# EAGLE design 01 (EAGLE 6.6.0)
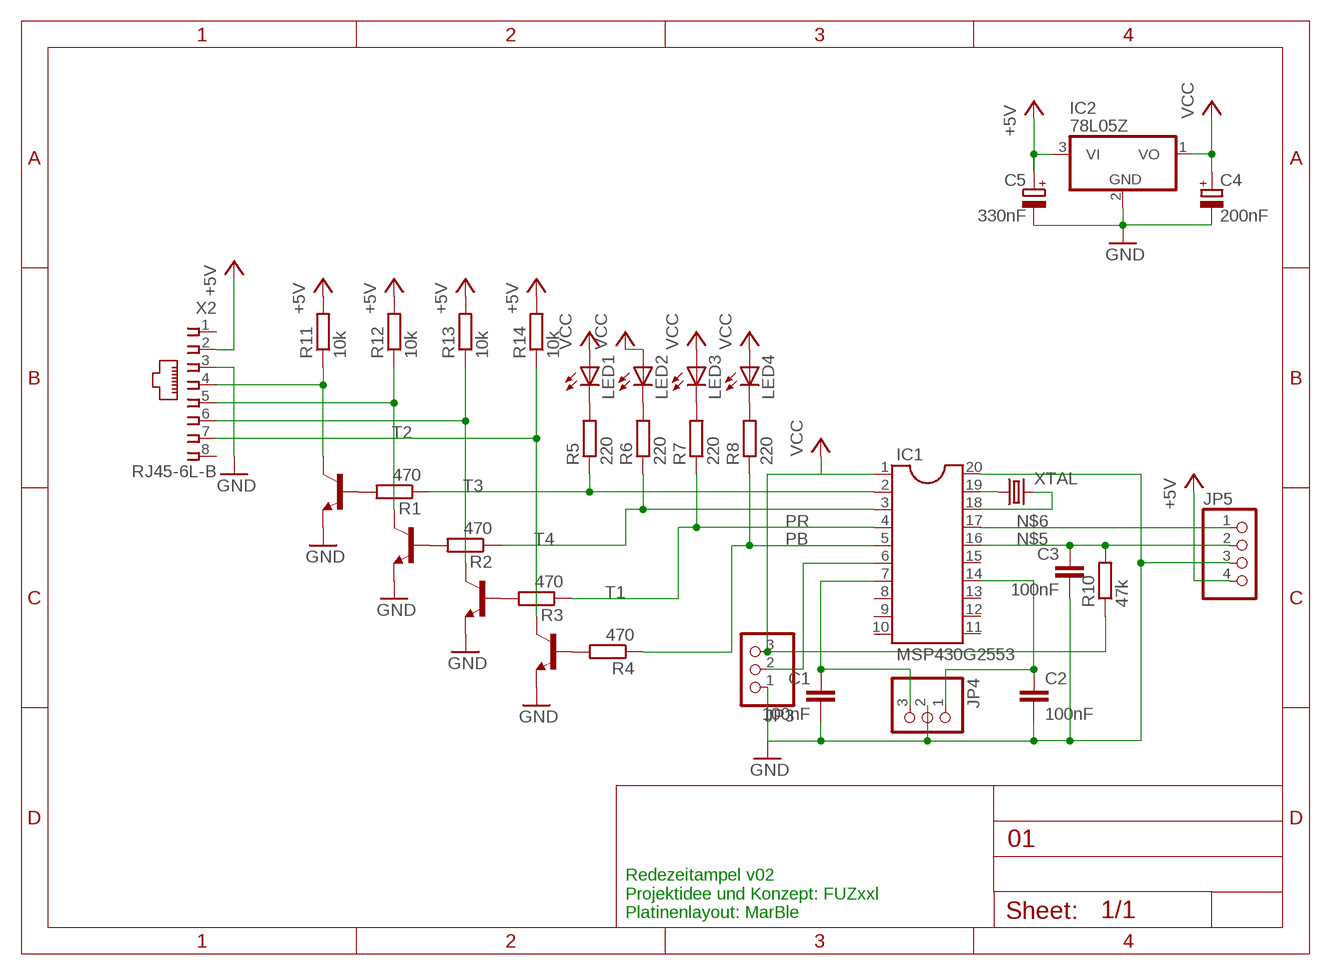
[diagram p0: schematic, sheet 1]

## Parts
C1  100nF  C-EU025-024X044  [C025-024X044]
C2  100nF  C-EU025-024X044  [C025-024X044]
C3  100nF  C-EU025-024X044  [C025-024X044]
C4  200nF  CPOL-EUB45181A  [B45181A]
C5  330nF  CPOL-EUB45181A  [B45181A]
IC1  MSP430G2553  DIL20  [DIL20]
IC2  78L05Z  [TO92]
JP3  PINHD-1X3  [1X03]
JP4  PINHD-1X3  [1X03]
JP5  PINHD-1X4/90  [1X04/90]
LED1  LED5MM  [LED5MM]
LED2  LED5MM  [LED5MM]
LED3  LED5MM  [LED5MM]
LED4  LED5MM  [LED5MM]
R1  470  R-EU_0207/10  [0207/10]
R2  470  R-EU_0207/10  [0207/10]
R3  470  R-EU_0207/10  [0207/10]
R4  470  R-EU_0207/10  [0207/10]
R5  220  R-EU_0207/10  [0207/10]
R6  220  R-EU_0207/10  [0207/10]
R7  220  R-EU_0207/10  [0207/10]
R8  220  R-EU_0207/10  [0207/10]
R10  47k  R-EU_0207/10  [0207/10]
R11  10k  R-EU_0207/10  [0207/10]
R12  10k  R-EU_0207/10  [0207/10]
R13  10k  R-EU_0207/10  [0207/10]
R14  10k  R-EU_0207/10  [0207/10]
T1  -NPN-TO92-EBC  [TO92-EBC]
T2  -NPN-TO92-EBC  [TO92-EBC]
T3  -NPN-TO92-EBC  [TO92-EBC]
T4  -NPN-TO92-EBC  [TO92-EBC]
X2  RJ45-6L-B  [RJ45-NO-SHIELD]
XTAL  CRYSTALTC26H  [TC26H]

## Nets
+5V: C5.+ IC2.3(VI) JP5.4 R11.2 R12.2 R13.2 R14.2 X2.2
GND: C1.2 C2.2 C3.2 C4.- C5.- IC1.20 IC2.2(GND) JP3.1 JP4.2 JP5.3 T1.E T2.E T3.E T4.E X2.3
N$1: IC1.6 JP3.2
N$2: IC1.19 XTAL.1
N$3: C1.1 IC1.7 JP4.3
N$4: C2.1 IC1.14 JP4.1
N$5: C3.1 IC1.16 JP5.2 R10.2
N$6: IC1.17 JP5.1
N$7: IC1.18 XTAL.2
N$8: LED4.K(C) R8.2
N$9: IC1.3 R2.1 R6.1
N$11: R4.2 T1.B
N$12: IC1.2 R1.1 R5.1
N$13: LED1.K(C) R5.2
N$16: R1.2 T2.B
N$17: LED2.K(C) R6.2
N$20: R2.2 T3.B
N$21: LED3.K(C) R7.2
N$23: R3.2 T4.B
N$27: R14.1 T1.C X2.7
N$28: R13.1 T4.C X2.6
N$29: R12.1 T3.C X2.5
N$30: R11.1 T2.C X2.4
PB: IC1.5 R4.1 R8.1
PR: IC1.4 R3.1 R7.1
VCC: C4.+ IC1.1 IC2.1(VO) JP3.3 LED1.A LED2.A LED3.A LED4.A R10.1
Unconnected: IC1.8 IC1.9 IC1.10 IC1.11 IC1.12 IC1.13 IC1.15 X2.1 X2.8

## Notes on the sheet
- Redezeitampel v02
  Projektidee und Konzept: FUZxxl
  Platinenlayout: MarBle

## Library data of the parts
C1-C3 = rcl:C-EU: CAPACITOR, European symbol
C4 C5 = rcl:CPOL-EU: POLARIZED CAPACITOR, European symbol
IC1 = ic-package:DIL20: Dual In Line / Socket
IC2 = linear:78*: Positive VOLTAGE REGULATOR Source: http://cache.national.com/ds/LM/LM78L05.pdf http://www.fairchildsemi.com/ds/LM/LM7805.pdf
JP3 JP4 = pinhead:PINHD-1X3: PIN HEADER
JP5 = pinhead:PINHD-1X4: PIN HEADER
LED1-LED4 = led:LED: LED OSRAM: - CHIPLED LG R971, LG N971, LY N971, LG Q971, LY Q971, LO R971, LY R971 LH N974, LH R974 LS Q976, LO Q976, LY Q976 LO Q996 - Hyper CHIPLED LW Q18S LB Q993, LB Q99A, LB R99A - SideLED LS A670, LO A670, LY A670, LG A670, LP A670 LB A673, LV A673, LT A673, LW A673 LH A674 LY A675 LS A676, LA A676, LO A676, LY A676, LW A676 LS A679, LY A679, LG A679 - Hyper Micro SIDELED® LS Y876, LA Y876, LO Y876, LY Y876 LT Y87S - SmartLED LW L88C, LW L88S LB L89C, LB L89S, LG L890 LS L89K, LO L89K, LY L89K LS L896, LA L896, LO L896, LY L896 - TOPLED LS T670, LO T670, LY T670, LG T670, LP T670 LSG T670, LSP T670, LSY T670, LOP T670, LYG T670 LG T671, LOG T671, LSG T671 LB T673, LV T673, LT T673, LW T673 LH T674 LS T676, LA T676, LO T676, LY T676, LB T676, LH T676, LSB T676, LW T676 LB T67C, LV T67C, LT T67C, LS T67K, LO T67K, LY T67K, LW E67C LS E67B, LA E67B, LO E67B, LY E67B, LB E67C, LV E67C, LT E67C LW T67C LS T679, LY T679, LG T679 LS T770, LO T770, LY T770, LG T770, LP T770 LB T773, LV T773, LT T773, LW T773 LH T774 LS E675, LA E675, LY E675, LS T675 LS T776, LA T776, LO T776, LY T776, LB T776 LHGB T686 LT T68C, LB T68C - Hyper Mini TOPLED® LB M676 - Mini TOPLED Santana® LG M470 LS M47K, LO M47K, LY M47K Source: http://www.osram.convergy.de LUXEON: - LUMILED® LXK2-PW12-R00, LXK2-PW12-S00, LXK2-PW14-U00, LXK2-PW14-V00 LXK2-PM12-R00, LXK2-PM12-S00, LXK2-PM14-U00 LXK2-PE12-Q00, LXK2-PE12-R00, LXK2-PE12-S00, LXK2-PE14-T00, LXK2-PE14-U00 LXK2-PB12-K00, LXK2-PB12-L00, LXK2-PB12-M00, LXK2-PB14-N00, LXK2-PB14-P00, LXK2-PB14-Q00 LXK2-PR12-L00, LXK2-PR12-M00, LXK2-PR14-Q00, LXK2-PR14-R00 LXK2-PD12-Q00, LXK2-PD12-R00, LXK2-PD12-S00 LXK2-PH12-R00, LXK2-PH12-S00 LXK2-PL12-P00, LXK2-PL12-Q00, LXK2-PL12-R00 Source: www.luxeon.com KINGBRIGHT: KA-3528ASYC Source: www.kingbright.com
R1-R8 R10-R14 = rcl:R-EU_: RESISTOR, European symbol
T1-T4 = transistor:*-NPN-: NPN Transistror BF959 corrected 2008.03.06
X2 = con-tycoelectronics:RJ45: CORCOM Modular RJ Jacks No Shield Source: www.tycoelectronics.com .. ENG_DS_1654001_1099_RJ_L_0507.pdf; MPN: RJ45-6L-B; OC_FARNELL: unknown; OC_NEWARK: 16R6090
XTAL = crystal:CRYSTAL: CRYSTAL; OC_FARNELL: unknown; OC_NEWARK: unknown

## Board
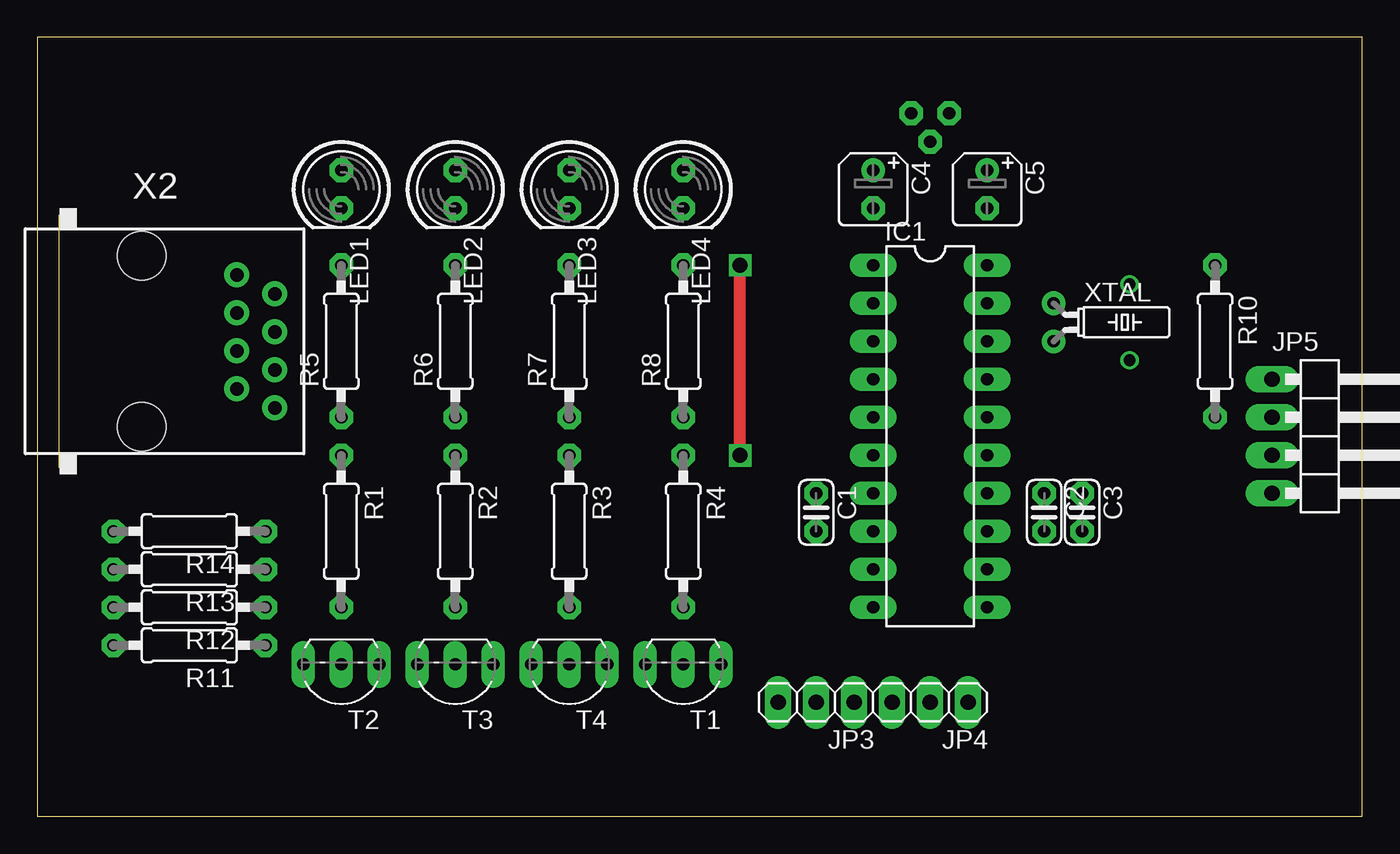
[diagram p1: board, top side]
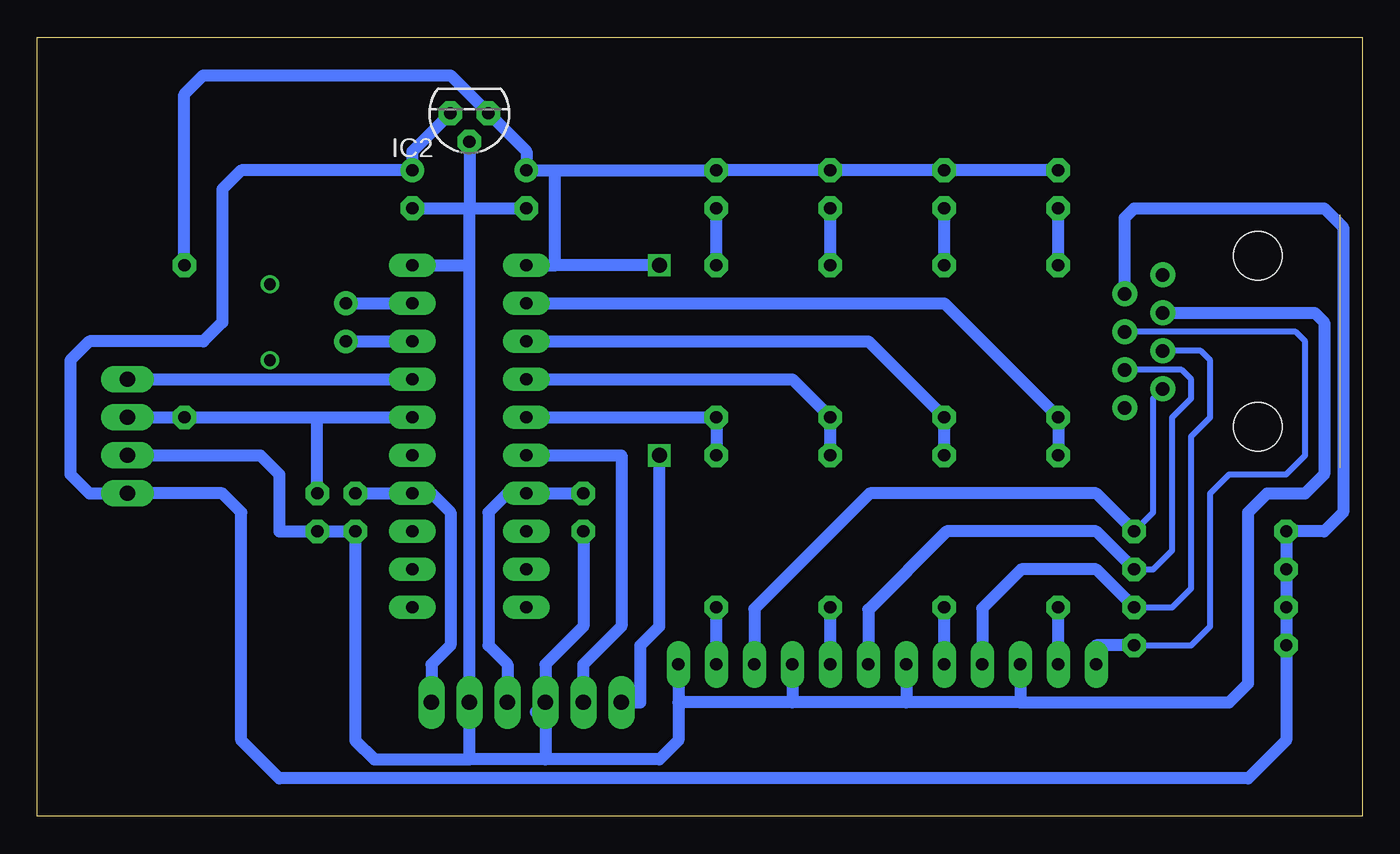
[diagram p2: board, bottom side, seen from below]

Size 88.57 x 52.06 mm. Coordinates in mm from the lower left corner, seen from the top.
Outline: 0,0 88.57,0 88.57,52.06 0,52.06 0,0
Copper layers (1*16): Top 0.035mm / dielectric 1.5mm / Bottom 0.035mm
Design rules "default *": minimum track width 10mil, minimum drill 24mil, track to track 8mil, track to pad 8mil, pad to pad 8mil, via to via 8mil, smd to smd 8mil, copper to edge 40mil, drill to drill 8mil, minimum pad ring 10mil, minimum via ring 8mil, stop-mask expansion 4mil, vias tented up to drill 0mil, thermal gap 10mil

### Footprints (pad centres in the part's own frame; a part is rotated, then mirrored left to right if it is on the bottom)
C025-024X044 = drill 0.813 octagon: 1 -1.27,0; 2 1.27,0
B45181A = drill 0.813 pad 1.6: + -1.27,0 | drill 0.813 pad 1.6 octagon: - 1.27,0
DIL20 = drill 0.813 long: 1 -11.43,-3.81; 2 -8.89,-3.81; 3 -6.35,-3.81; 4 -3.81,-3.81; 5 -1.27,-3.81; 6 1.27,-3.81; 7 3.81,-3.81; 8 6.35,-3.81; 9 8.89,-3.81; 10 11.43,-3.81; 11 11.43,3.81; 12 8.89,3.81; 13 6.35,3.81; 14 3.81,3.81; 15 1.27,3.81; 16 -1.27,3.81; 17 -3.81,3.81; 18 -6.35,3.81; 19 -8.89,3.81; 20 -11.43,3.81
TO92 = drill 0.813 octagon: 1 -1.27,0; 2 0,1.905; 3 1.27,0
1X03 = drill 1.016 long: 1 -2.54,0; 2 0,0; 3 2.54,0
1X04/90 = drill 1.016 long: 1 -3.81,-3.81; 2 -1.27,-3.81; 3 1.27,-3.81; 4 3.81,-3.81
LED5MM = drill 0.813 octagon: A -1.27,0; K 1.27,0
0207/10 = drill 0.813 octagon: 1 -5.08,0; 2 5.08,0
TO92-EBC = drill 0.813 long: B 0,-1.27; C 2.54,-1.27; E -2.54,-1.27
RJ45-NO-SHIELD = drill 0.9 pad 1.4: 1 -4.445,6.35; 2 -3.175,8.89; 3 -1.905,6.35; 4 -0.635,8.89; 5 0.635,6.35; 6 1.905,8.89; 7 3.175,6.35; 8 4.445,8.89 | hole 3.251: -5.715,0; 5.715,0
TC26H = drill 0.813: 1 -1.27,0; 2 1.27,0

### Placement (x,y rotation side)
C1  52.07,20.32 270 top
C2  67.31,20.32 270 top
C3  69.85,20.32 270 top
C4  55.88,41.91 270 top
C5  63.5,41.91 270 top
IC1  59.69,25.4 270 top
IC2  59.69,46.99 180 bottom
JP3  52.07,7.62 180 top
JP4  59.69,7.62 180 top
JP5  86.36,25.4 270 top
LED1  20.32,41.91 270 top
LED2  27.94,41.91 270 top
LED3  35.56,41.91 270 top
LED4  43.18,41.91 270 top
R1  20.32,19.05 270 top
R2  27.94,19.05 270 top
R3  35.56,19.05 270 top
R4  43.18,19.05 270 top
R5  20.32,31.75 90 top
R6  27.94,31.75 90 top
R7  35.56,31.75 90 top
R8  43.18,31.75 90 top
R10  78.74,31.75 270 top
R11  10.16,11.43 180 top
R12  10.16,13.97 180 top
R13  10.16,16.51 180 top
R14  10.16,19.05 180 top
T1  43.18,8.89 180 top
T2  20.32,8.89 180 top
T3  27.94,8.89 180 top
T4  35.56,8.89 180 top
X2  6.99,31.75 270 top
XTAL  67.94,33.02 270 top

### Tracks (layer width: path | path; a pad name or v marks a point on that pad's centre or on a via)
+5V
  Bottom 0.813: R14.2 R13.2 R12.2 R11.2 | IC2.3 63.5,44.45 C5.+ 74.93,43.18 76.2,41.91 76.2,33.02 77.47,31.75 85.09,31.75 86.36,30.48 86.36,22.86 85.09,21.59 JP5.4 76.2,21.59 74.93,20.32 74.93,5.08 72.39,2.54 7.62,2.54 5.08,5.08 R11.2 | R14.2 R11.2 | R14.2 2.54,19.05 1.27,20.32 1.27,39.37 2.54,40.64 15.24,40.64 15.88,40.01 X2.2
GND
  Bottom 0.813: 22.86,7.62 30.48,7.62 | T3.E 30.48,7.62 | 30.48,7.62 38.1,7.62 | T4.E 38.1,7.62 | 38.1,7.62 45.72,7.62 | T1.E 45.72,7.62 | C5.- 59.69,40.64 | 59.69,40.64 C4.- | IC2.2 59.69,40.64 | IC1.20 59.69,36.83 | 59.69,36.83 59.69,40.64 | 59.69,36.83 JP4.2 59.69,3.81 | 45.72,7.62 45.72,5.08 46.99,3.81 54.61,3.81 | 54.61,3.81 59.69,3.81 | 59.69,3.81 66.04,3.81 67.31,5.08 C2.2 C3.2 72.39,19.05 72.39,22.86 73.66,24.13 JP5.3 | C1.2 52.07,12.7 54.61,10.16 JP3.1 | 55.24,6.99 JP3.1 | JP3.1 54.61,3.81 | T2.E 22.86,7.62 | 22.86,7.62 8.89,7.62 7.62,8.89 7.62,20.32 6.35,21.59 3.81,21.59 2.54,22.86 2.54,33.02 3.17,33.66 X2.3
N$1
  Bottom 0.813: JP3.2 52.07,10.16 49.53,12.7 49.53,24.13 IC1.6
N$2
  Bottom 0.813: XTAL.1 IC1.19
N$3
  Bottom 0.813: C1.1 IC1.7 57.15,21.59 58.42,20.32 58.42,11.43 57.15,10.16 JP4.3
N$4
  Bottom 0.813: C2.1 IC1.14 62.23,21.59 60.96,20.32 60.96,11.43 62.23,10.16 JP4.1
N$5
  Bottom 0.813: JP5.2 R10.2 69.85,26.67 | 69.85,26.67 IC1.16 | C3.1 69.85,26.67
N$6
  Bottom 0.813: JP5.1 IC1.17
N$7
  Bottom 0.813: XTAL.2 IC1.18
N$8
  Bottom 0.813: R8.2 LED4.K
N$9
  Bottom 0.813: R2.1 R6.1 33.02,31.75 IC1.3
N$11
  Bottom 0.813: T1.B R4.2
N$12
  Bottom 0.813: R1.1 R5.1 27.94,34.29 IC1.2
N$13
  Bottom 0.813: R5.2 LED1.K
N$16
  Bottom 0.813: T2.B R1.2
N$17
  Bottom 0.813: R6.2 LED2.K
N$18  (via drill 0.8)
  other vias: 73.03,35.56
N$20
  Bottom 0.813: T3.B R2.2
N$21
  Bottom 0.813: R7.2 LED3.K
N$23
  Bottom 0.813: T4.B R3.2
N$24  (via drill 0.8)
  other vias: 73.03,30.48
N$27
  Bottom 0.406: R14.1 13.97,20.32 13.97,27.94 X2.7
  Bottom 0.813: R14.1 17.78,21.59 32.91,21.59 40.64,13.87 T1.C
N$28
  Bottom 0.406: R13.1 13.97,16.51 12.7,17.78 12.7,26.67 11.43,27.94 11.43,29.21 12.06,29.84 X2.6
  Bottom 0.813: R13.1 17.78,19.05 27.78,19.05 33.02,13.81 T4.C
N$29
  Bottom 0.406: R12.1 12.7,13.97 11.43,15.24 11.43,25.4 10.16,26.67 10.16,30.48 10.79,31.11 X2.5
  Bottom 0.813: R12.1 17.78,16.51 22.78,16.51 25.4,13.89 T3.C
N$30
  Bottom 0.406: R11.1 11.43,11.43 10.16,12.7 10.16,21.59 8.89,22.86 5.08,22.86 3.81,24.13 3.81,31.75 4.45,32.38 X2.4
  Bottom 0.813: R11.1 17.78,11.43 T2.C
PB
  Bottom 0.813: R4.1 R8.1 IC1.5
PR
  Bottom 0.813: R3.1 R7.1 38.1,29.21 IC1.4
VCC  (via drill 1)
  Top 0.813: v46.99,24.13 v46.99,36.83
  Bottom 0.813: LED1.A LED2.A LED3.A LED4.A 53.98,43.18 | 53.98,43.18 C4.+ 55.88,44.45 IC2.1 60.96,49.53 77.47,49.53 78.74,48.26 R10.1 | IC1.1 53.98,36.83 | 53.98,36.83 53.98,43.18 | JP3.3 48.26,7.62 48.26,11.43 46.99,12.7 v46.99,24.13 | v46.99,36.83 53.98,36.83